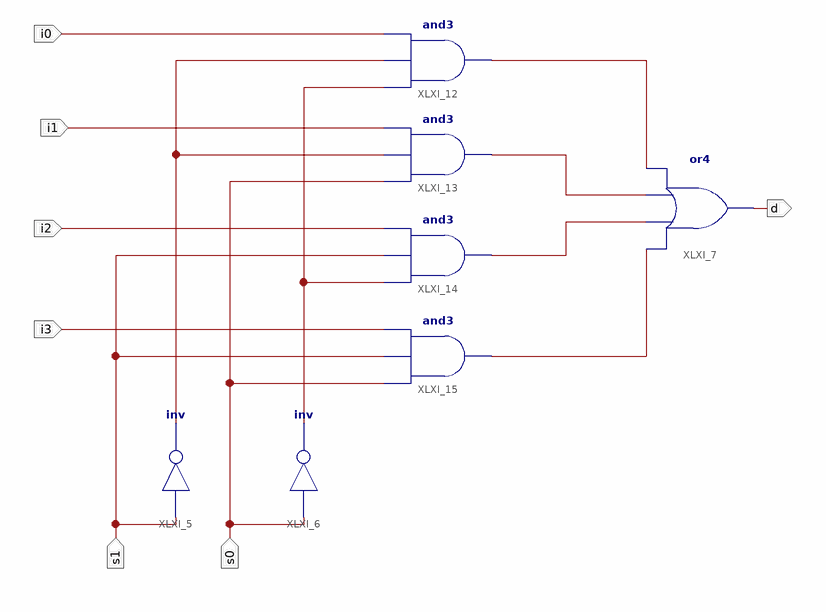
[diagram p0: schematic sheet 1]
// Xilinx ISE schematic computer_data_bus.sch (spartan3e) as structural Verilog: 7 symbols, 7 ports
module computer_data_bus (
  input  s1,
  input  s0,
  input  i0,
  input  i1,
  input  i2,
  input  i3,
  output d
);

  wire XLXN_8, XLXN_9, XLXN_10, XLXN_11, XLXN_24, XLXN_25;

  or XLXI_7 (d, XLXN_11, XLXN_10, XLXN_9, XLXN_8);
  not XLXI_5 (XLXN_24, s1);
  and XLXI_12 (XLXN_8, XLXN_25, XLXN_24, i0);
  and XLXI_13 (XLXN_9, s0, XLXN_24, i1);
  and XLXI_14 (XLXN_10, XLXN_25, s1, i2);
  and XLXI_15 (XLXN_11, s0, s1, i3);
  not XLXI_6 (XLXN_25, s0);
endmodule
